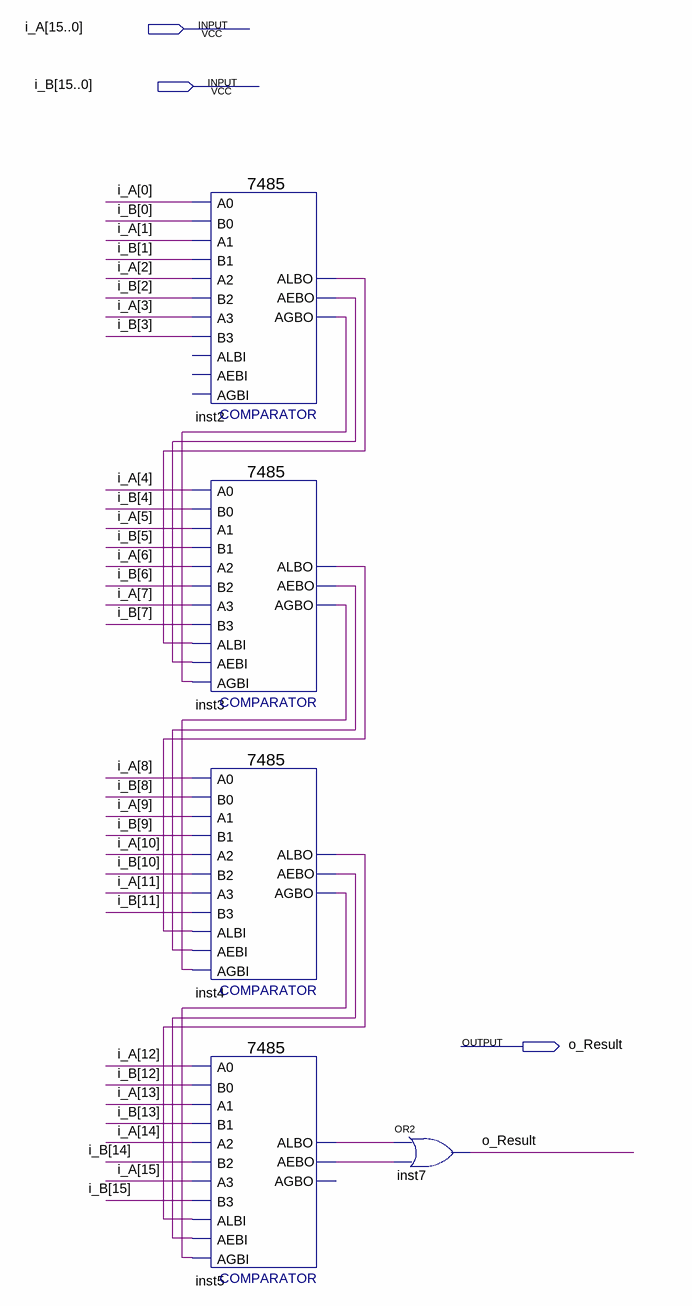
[diagram p0: schematic sheet]
// Quartus schematic comparator_4bit.bdf as structural Verilog: 5 symbols, 3 pins
module comparator_4bit (
  input  [15:0] i_A,
  input  [15:0] i_B,
  output o_Result
);

  wire inst2_aebo, inst2_agbo, inst2_albo, inst3_aebo, inst3_agbo, inst3_albo, inst4_aebo, inst4_agbo,
       inst4_albo, inst5_aebo, inst5_albo;

  \7485  inst2 (
    .A3(i_A[3]), .B2(i_B[2]), .A2(i_A[2]), .A0(i_A[0]), .B0(i_B[0]), .B3(i_B[3]), .A1(i_A[1]), .B1(i_B[1]),
    .ALBO(inst2_albo), .AGBO(inst2_agbo), .AEBO(inst2_aebo));  // open: AEBI, AGBI, ALBI
  \7485  inst3 (
    .A3(i_A[7]), .B2(i_B[6]), .A2(i_A[6]), .AEBI(inst2_aebo), .AGBI(inst2_agbo), .ALBI(inst2_albo),
    .A0(i_A[4]), .B0(i_B[4]), .B3(i_B[7]), .A1(i_A[5]), .B1(i_B[5]), .ALBO(inst3_albo), .AGBO(inst3_agbo),
    .AEBO(inst3_aebo));
  \7485  inst4 (
    .A3(i_A[11]), .B2(i_B[10]), .A2(i_A[10]), .AEBI(inst3_aebo), .AGBI(inst3_agbo), .ALBI(inst3_albo),
    .A0(i_A[8]), .B0(i_B[8]), .B3(i_B[11]), .A1(i_A[9]), .B1(i_B[9]), .ALBO(inst4_albo), .AGBO(inst4_agbo),
    .AEBO(inst4_aebo));
  \7485  inst5 (
    .A3(i_A[15]), .B2(i_B[14]), .A2(i_A[14]), .AEBI(inst4_aebo), .AGBI(inst4_agbo), .ALBI(inst4_albo),
    .A0(i_A[12]), .B0(i_B[12]), .B3(i_B[15]), .A1(i_A[13]), .B1(i_B[13]), .ALBO(inst5_albo), .AEBO(inst5_aebo));  // open: AGBO
  or inst7 (o_Result, inst5_albo, inst5_aebo);
endmodule
